# EasyEDA Pro project ProPrj_两相交错电源demo_2025-05-26.epro, schematic Schematic5
Board Name: 5143数控板; Create Date: 2025-05-10; Page Name: P1; Project Name: 两相交错电源demo; Schematic Name: Schematic5; Update Date: 2025-05-23; Company: 嘉立创EDA; Page Size: A4; Version: V1.0
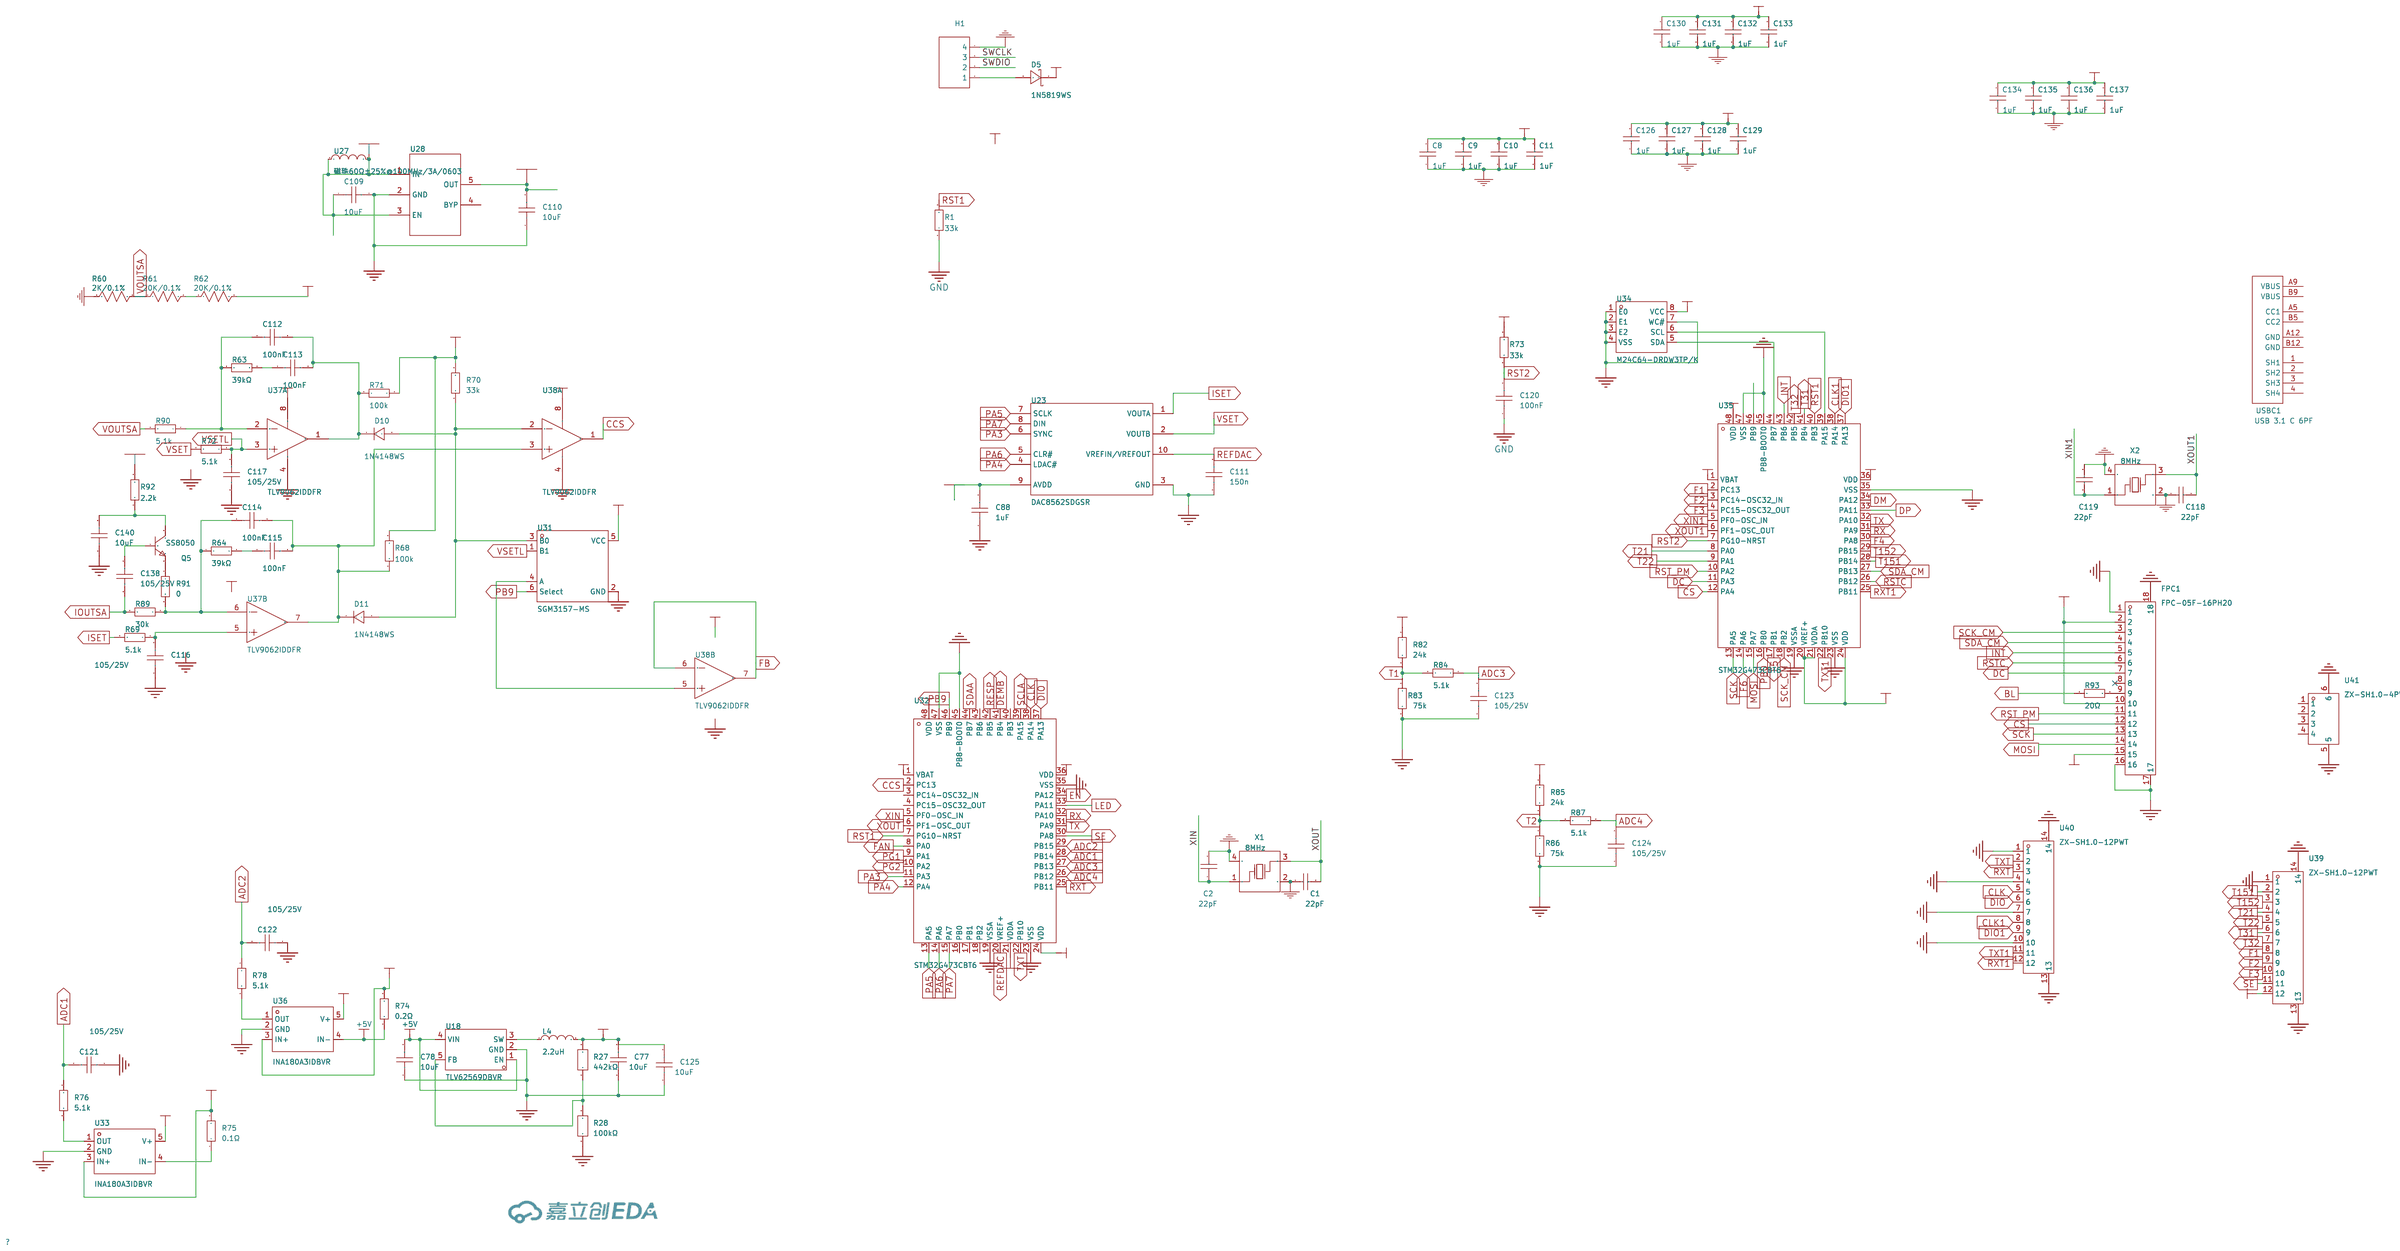
[diagram p5: schematic sheet]

## Parts
C1  22pF  [C0603]
C2  22pF  [C0603]
C8  1uF  [C0603]
C9  1uF  [C0603]
C10  1uF  [C0603]
C11  1uF  [C0603]
C77  10uF  [C0603]
C78  10uF  [C0603]
C88  1uF  [C0603]
C109  10uF  [C0603]
C110  10uF  [C0603]
C111  150n  [C0603]
C112  100nF  [C0603]
C113  100nF  [C0603]
C114  100nF  [C0603]
C115  100nF  [C0603]
C116  105/25V  [C0603]
C117  105/25V  [C0603]
C118  22pF  [C0603]
C119  22pF  [C0603]
C120  100nF  [C0603]
C121  105/25V  [C0603]
C122  105/25V  [C0603]
C123  105/25V  [C0603]
C124  105/25V  [C0603]
C125  10uF  [C0603]
C126  1uF  [C0603]
C127  1uF  [C0603]
C128  1uF  [C0603]
C129  1uF  [C0603]
C130  1uF  [C0603]
C131  1uF  [C0603]
C132  1uF  [C0603]
C133  1uF  [C0603]
C134  1uF  [C0603]
C135  1uF  [C0603]
C136  1uF  [C0603]
C137  1uF  [C0603]
C138  105/25V  [C0603]
C140  10uF  [C0603]
D5  1N5819WS  [SOD-323_L1.8-W1.3-LS2.5-RD]
D10  1N4148WS  [SOD-323_L1.8-W1.3-LS2.5-RD]
D11  1N4148WS  [SOD-323_L1.8-W1.3-LS2.5-RD]
FPC1  FPC-05F-16PH20  [FPC-SMD_16P-P0.50_FPC-05F-16PH20]
H1  Header-Male-2.54_1x4  [HDR-TH_4P-P2.54-V-M]
L4  2.2uH  [IND-SMD_L4.9-W4.4_MAPM0420F]
Q5  SS8050  [SOT-23-3_L2.9-W1.3-P1.90-LS2.4-BR]
R1  33k  [R0603]
R27  442kΩ  [R0603]
R28  100kΩ  [R0603]
R60  2K/0.1%  [R0603]
R61  20K/0.1%  [R0603]
R62  20K/0.1%  [R0603]
R63  39kΩ  [R0603]
R64  39kΩ  [R0603]
R68  100k  [R0603]
R69  5.1k  [R0603]
R70  33k  [R0603]
R71  100k  [R0603]
R72  5.1k  [R0603]
R73  33k  [R0603]
R74  0.2Ω  [R0603]
R75  0.1Ω  [R0603]
R76  5.1k  [R0603]
R78  5.1k  [R0603]
R82  24k  [R0603]
R83  75k  [R0603]
R84  5.1k  [R0603]
R85  24k  [R0603]
R86  75k  [R0603]
R87  5.1k  [R0603]
R89  30k  [R0603]
R90  5.1k  [R0603]
R91  0  [R0603]
R92  2.2k  [R0603]
R93  20Ω  [R0805]
U18  TLV62569DBVR  [SOT-23-5_L3.0-W1.7-P0.95-LS2.8-BR]
U23  DAC8562SDGSR  [VSSOP-10_L3.0-W3.0-P0.50-LS4.9-BL]
U27  磁珠60Ω±25%@100MHz/3A/0603  [L0603]
U28  -  [SOT-23-5_L3.0-W1.7-P0.95-LS2.8-TL]
U31  SGM3157-MS  [SC-70-6_L2.0-W1.3-P0.65-LS2.1-BL]
U32  STM32G473CBT6  [LQFP-48_L7.0-W7.0-P0.50-LS9.0-BL]
U33  INA180A3IDBVR  [SOT-23-5_L3.0-W1.7-P0.95-LS2.8-BR]
U34  M24C64-DRDW3TP/K  [TSSOP-8_L4.4-W3.0-P0.65-LS6.4-BL]
U35  STM32G473CBT6  [LQFP-48_L7.0-W7.0-P0.50-LS9.0-BL]
U36  INA180A3IDBVR  [SOT-23-5_L3.0-W1.7-P0.95-LS2.8-BR]
U37  TLV9062IDDFR  [TSOT-23-8_L2.9-W1.6-P0.65-LS2.8-BL]  (sections 1,2)
U38  TLV9062IDDFR  [TSOT-23-8_L2.9-W1.6-P0.65-LS2.8-BL]  (sections 1,2)
U39  ZX-SH1.0-12PWT  [CONN-SMD_ZX-SH1.0-12PWT]
U40  ZX-SH1.0-12PWT  [CONN-SMD_ZX-SH1.0-12PWT]
U41  ZX-SH1.0-4PWT  [CONN-SMD_4P-P1.00_MEGASTAR_ZX-SH1.0-4PWT]
USBC1  USB 3.1 C 6PF  [USB-C-SMD_TYPE-C-USB-13]
X1  8MHz  [OSC-SMD_4P-L3.2-W2.5-BL]
X2  8MHz  [OSC-SMD_4P-L3.2-W2.5-BL]

## Library data of the parts
C1 C2 C118 C119 = 22pF: Supplier: LCSC; Manufacturer: FH; Manufacturer Part: 0402CG150J500NT; Supplier Part: C1548; JLCPCB Part Class: Basic Part
C8-C11 C126-C137 = 100nF: Supplier: LCSC; Manufacturer: YAGEO; Manufacturer Part: CC0603KRX7R8BB334; Supplier Part: C107070; JLCPCB Part Class: Extended Part
C77 C78 C125 = CL10A475KO8NNNC: 容值:4.7uF;精度:±10%;额定电压:16V;材质(温度系数):X5R;; LCSC Part Name: 4.7uF ±10% 16V; Supplier Part: C19666; Manufacturer: SAMSUNG(三星); Supplier Footprint: 0603; JLCPCB Part Class: 基础库; Datasheet: https://atta.szlcsc.com/upload/public/pdf/source/20160218/1457707763339.pdf; Supplier: LCSC; Tolerance: ±10%; Voltage Rated: 16V; Temperature Coefficient: X5R
C88 C111 = CL10F105ZP8NNNC: 容值:1uF;精度:-20%~+80%;额定电压:10V;材质(温度系数):Y5V;; LCSC Part Name: 1uF -20%~+80% 10V; Supplier Part: C84710; Manufacturer: SAMSUNG(三星); Supplier Footprint: 0603; JLCPCB Part Class: 扩展库; Datasheet: https://atta.szlcsc.com/upload/public/pdf/source/20161228/1482890885897.pdf; Supplier: LCSC; Tolerance: -20%~+80%; Voltage Rated: 10V; Temperature Coefficient: Y5V
C109 C110 C140 = C0805S102K1RAC7800: 容值:1nF;精度:±10%;额定电压:100V;温度系数:X7R;; LCSC Part Name: 1nF ±10% 100V; Supplier Part: C141167; Manufacturer: KEMET(基美); Supplier Footprint: 0805; Datasheet: https://atta.szlcsc.com/upload/public/pdf/source/20171201/C141167_15121177000921156234.pdf; Supplier: LCSC; Tolerance: ±10%; Voltage Rated: 100V; Temperature Coefficient: X7R
C112-C115 C120 = CC0603KRX7R9BB104: 容值:100nF;精度:±10%;额定电压:50V;材质(温度系数):X7R;; LCSC Part Name: 100nF ±10% 50V; Supplier Part: C14663; Manufacturer: YAGEO(国巨); Supplier Footprint: 0603; JLCPCB Part Class: 基础库; Datasheet: https://atta.szlcsc.com/upload/public/pdf/source/20180910/C282072_33301C7F631E79921B82A8DAC6BCC5B3.pdf; Supplier: LCSC; Tolerance: ±10%; Voltage Rated: 50V; Temperature Coefficient: X7R
C116 C117 C121-C124 C138 = 105/25V: Supplier: LCSC
D5 = 1N5819WS_C191023: 正向压降(Vf):600mV@1A;直流反向耐压(Vr):40V;整流电流:1A;; LCSC Part Name: 电压:40V 电流:1A; Supplier Part: C191023; Manufacturer: Hottech(合科泰); Supplier Footprint: SOD-323; JLCPCB Part Class: 基础库; Datasheet: https://atta.szlcsc.com/upload/public/pdf/source/20220428/3CB86FD8D28D653594B4E35F9D5AEFD9.pdf; Supplier: LCSC; Forward Voltage (Vf@If): 600mV@1A; Reverse Voltage (Vr): 40V; Rectified Current: 1A
D10 D11 = 1N4148WS_C2128: 二极管配置:独立式;正向压降(Vf):1.25V@150mA;直流反向耐压(Vr):100V;整流电流:150mA;反向恢复时间(Trr):4ns;; LCSC Part Name: 丝印T4 1N4148WS; Supplier Part: C2128; Manufacturer: CJ(江苏长电/长晶); Supplier Footprint: SOD-323; JLCPCB Part Class: 基础库; Datasheet: https://atta.szlcsc.com/upload/public/pdf/source/20140809/1457707208178.pdf; Supplier: LCSC; Diode Configuration: 独立式; Voltage - Forward(Vf@If): 1.25V@150mA; Voltage - DC Reverse(Vr): 100V; Current - Rectified: 150mA; Reverse Leakage Current (Ir): 1uA@75V; Reverse Recovery Time (trr): 4ns
FPC1 = FPC-05F-16PH20: 锁定特性:翻盖式;触点类型:下接;触点数量:16P;间距:0.5mm;安装类型:卧贴;工作温度范围:-25℃~+85℃;; LCSC Part Name: 间距:0.5mm P数:16P 翻盖式 下接; Supplier Part: C2856801; Manufacturer: XUNPU(讯普); Supplier Footprint: SMD,P=0.5mm,卧贴; JLCPCB Part Class: 扩展库; Datasheet: https://atta.szlcsc.com/upload/public/pdf/source/20210922/C2856801_73A554E58C5577257FCEC843978D3BA6.pdf; Supplier: LCSC; Locking Feature: 翻盖式; Contact Type: 下接; Number of Contacts: 16P; Pitch: 0.5mm; Mounting Type: 卧贴; FFC, FCB Thickness: 0.3mm; Height Above Board: 2mm; Operating Temperature Range: -25℃~+85℃
H1 = Header-Male-2.54_1x4: Supplier: LCSC; Manufacturer: Ckmtw; Manufacturer Part: 210S-1*4P L=11.6MMGold-plated black; Supplier Part: C124378; JLCPCB Part Class: Extended Part
L4 = HA42-4R7MT: 电感值:4.7uH;精度:±20%;额定电流:2A;饱和电流(Isat):3A;; LCSC Part Name: 4.7uH ±20% 3A; Supplier Part: C2936653; Manufacturer: FH(风华); Supplier Footprint: 0420; JLCPCB Part Class: 扩展库; Datasheet: https://atta.szlcsc.com/upload/public/pdf/source/20211228/DF5AAD1C624D1DACD739A51BD94418BC.pdf; Supplier: LCSC; Tolerance: ±20%; Rated Current: 2A; Saturation Current (Isat): 3A; DC Resistance (DCR): 150mΩ
Q5 = SS8050_C2150: 晶体管类型:NPN;集电极电流(Ic):1.5A;集射极击穿电压(Vceo):25V;功率(Pd):300mW;直流电流增益(hFE@Ic,Vce):200@100mA,1V;; LCSC Part Name: SS8050(RANGE:200-350) hfe=200~350; Supplier Part: C2150; Manufacturer: CJ(江苏长电/长晶); Supplier Footprint: SOT-23; Datasheet: https://atta.szlcsc.com/upload/public/pdf/source/20230322/AEE86F4B043774EFF80CAEA14A37D9E9.pdf; Supplier: LCSC; Transistor Type: NPN; Collector Current (Ic): 1.5A; Collector-Emitter Breakdown Voltage (Vceo): 25V; Power Dissipation (Pd): 300mW; DC Current Gain (hFE@Ic,Vce): 200@100mA,1V; Transition Frequency (fT): 100MHz; Collector Cut-Off Current (Icbo): 100nA; Collector-Emitter Saturation Voltage (VCE(sat)@Ic,Ib): 500mV@800mA,80mA
R1 R68-R73 R76 R78 R82-R87 R89-R92 = 0603WAF1002T5E: LCSC Part Name: 10KΩ(1002) ±1% 编带; Supplier Part: C25804; Manufacturer: UNI-ROYAL(厚声); Supplier Footprint: 0603; JLCPCB Part Class: Basic Part; Datasheet: https://atta.szlcsc.com/upload/public/pdf/source/20170920/C25804_1505901551523983377.pdf; Supplier: LCSC
R27 = AR03BTCX2703: 电阻类型:薄膜电阻;阻值:270kΩ;精度:±0.1%;功率:100mW;最大工作电压:50V;温度系数:±25ppm/℃;; LCSC Part Name: 薄膜电阻 270kΩ ±0.1% 100mW; Supplier Part: C2828628; Manufacturer: Viking(光颉); Supplier Footprint: 0603; JLCPCB Part Class: 扩展库; Datasheet: https://atta.szlcsc.com/upload/public/pdf/source/20211009/C2828650_32843A9D611245FFE6ACF70CB68068A1.pdf; Supplier: LCSC; Type: 薄膜电阻; Tolerance: ±0.1%; Power(Watts): 100mW; Overload Voltage (Max): 50V; Temperature Coefficient: ±25ppm/℃; Operating Temperature Range: -55℃~+155℃
R28 = 0603WAF6002T5E: 电阻类型:厚膜电阻;阻值:60kΩ;精度:±1%;功率:100mW;最大工作电压:75V;温度系数:±100ppm/℃;; LCSC Part Name: 60kΩ ±1% 100mW 厚膜电阻; Supplier Part: C2767205; Manufacturer: UNI-ROYAL(厚声); Supplier Footprint: 0603; JLCPCB Part Class: 扩展库; Datasheet: https://atta.szlcsc.com/upload/public/pdf/source/20200306/C422600_1E6D84923E4A46A82E41ADD87F860B5C.pdf; Supplier: LCSC; Type: 厚膜电阻; Tolerance: ±1%; Power(Watts): 100mW; Overload Voltage (Max): 75V; Temperature Coefficient: ±100ppm/℃; Operating Temperature Range: -55℃~+155℃
R60 = 2K/0.1%: Supplier: LCSC
R61 R62 = 20K/0.1%: Supplier: LCSC
R63 R64 = 0603WAF3902T5E: 电阻类型:厚膜电阻;阻值:39kΩ;精度:±1%;功率:100mW;最大工作电压:75V;温度系数:±100ppm/℃;; LCSC Part Name: 39kΩ ±1% 100mW 厚膜电阻; Supplier Part: C23153; Manufacturer: UNI-ROYAL(厚声); Supplier Footprint: 0603; Datasheet: https://atta.szlcsc.com/upload/public/pdf/source/20200306/C422600_1E6D84923E4A46A82E41ADD87F860B5C.pdf; Supplier: LCSC; Type: 厚膜电阻; Tolerance: ±1%; Power(Watts): 100mW; Overload Voltage (Max): 75V; Temperature Coefficient: ±100ppm/℃; Operating Temperature Range: -55℃~+155℃
R74 R75 = 0603WAF100KT5E: 电阻类型:厚膜电阻;阻值:1Ω;精度:±1%;功率:100mW;最大工作电压:75V;温度系数:±400ppm/℃;; LCSC Part Name: 1Ω ±1% 100mW 厚膜电阻; Supplier Part: C22936; Manufacturer: UNI-ROYAL(厚声); Supplier Footprint: 0603; JLCPCB Part Class: 基础库; Datasheet: https://atta.szlcsc.com/upload/public/pdf/source/20200306/C422600_1E6D84923E4A46A82E41ADD87F860B5C.pdf; Supplier: LCSC; Type: 厚膜电阻; Tolerance: ±1%; Power(Watts): 100mW; Overload Voltage (Max): 75V; Temperature Coefficient: ±400ppm/℃; Operating Temperature Range: -55℃~+155℃
R93 = 0805W8F100KT5E: 电阻类型:厚膜电阻;阻值:1Ω;精度:±1%;功率:125mW;最大工作电压:150V;温度系数:±400ppm/℃;; LCSC Part Name: 1Ω ±1% 125mW 厚膜电阻; Supplier Part: C25271; Manufacturer: UNI-ROYAL(厚声); Supplier Footprint: 0805; JLCPCB Part Class: 基础库; Datasheet: https://atta.szlcsc.com/upload/public/pdf/source/20200306/C422600_1E6D84923E4A46A82E41ADD87F860B5C.pdf; Supplier: LCSC; Type: 厚膜电阻; Tolerance: ±1%; Power(Watts): 125mW; Overload Voltage (Max): 150V; Temperature Coefficient: ±400ppm/℃; Operating Temperature Range: -55℃~+155℃
U18 = TLV62569DBVR: 功能类型:降压型;输出类型:可调;工作电压:2.5V~5.5V;输出电压:600mV~5.5V;输出电流:2A;; LCSC Part Name: 高效率同步降压转换器; Supplier Part: C141836; Manufacturer: TI(德州仪器); Supplier Footprint: SOT-23-5; JLCPCB Part Class: 扩展库; Datasheet: https://www.ti.com/cn/lit/gpn/tlv62569; Supplier: LCSC; Function: 降压型; Output Type: 可调; Input Voltage: 2.5V~5.5V; Output Voltage: 600mV~5.5V; Output Current: 2A; Switching Frequency: 1.5MHz; Operating Temperature: -40℃~+125℃@(TJ); Synchronous Rectification: 是; Topology: 降压式; Switch tube (built-in/external): 内置
U23 = DAC8562SDGSR: DAC8562 具有 2.5V、4ppm/°C 基准的 16 位、双通道、低功耗、超低毛刺脉冲、电压输出 DAC; Supplier Part: C127965; Manufacturer: TI(德州仪器); Supplier Footprint: VSSOP-10-0.5mm; JLCPCB Part Class: 扩展库; Datasheet: https://www.ti.com/cn/lit/gpn/dac8562; Supplier: LCSC
U27 = 磁珠60Ω±25%@100MHz/3A/0603: Supplier Part: C9900021622; Supplier Footprint: 0603; JLCPCB Part Class: 扩展库; Supplier: LCSC
U28 = SPX3819M5-L-5-0/TR: 输出类型:固定;输出极性:正;输出通道数:1;最大输入电压:16V;输出电压:5V;压差:700mV@(500mA);输出电流:500mA;电源纹波抑制比(PRSS):-;; LCSC Part Name: Vin=16V Vout=5V 500mA; Supplier Part: C13417; Manufacturer: MaxLinear; Supplier Footprint: SOT-23-5; Datasheet: https://atta.szlcsc.com/upload/public/pdf/source/20150720/1457707331934.pdf; Supplier: LCSC; Output Type: 固定; Output Polarity: 正; Number of Outputs: 1; Maximum Input Voltage: 16V; Output Voltage: 5V; Dropout Voltage: 700mV@(500mA); Output Current: 500mA
U31 = SGM3157-MS: 此款高性能模拟开关，采用单刀双掷（SPDT）结构，单一通道设计精简高效。支持宽电压操作，确保广泛兼容性。让信号传输无缝对接，被广泛适用于音频切换、射频切换、数据采集系统、多路复用器、测试与测量设备等需要高性能模拟开关的应用场景。; Supplier Part: C30602480; Manufacturer: MSKSEMI(美森科); Supplier Footprint: SC-70-6; Datasheet: https://atta.szlcsc.com/upload/public/pdf/source/20240809/D2FA955BEE86AA69D9FAF919AB73E68A.pdf; Supplier: LCSC
U32 U35 = STM32G473CBT6: LCSC Part Name: 带DSP和FPU的170MHz主流ARM Cortex-M4 MCU，具有128 KB Flash存储器、数学加速器和高模拟电平集成; Supplier Part: C730111; Manufacturer: ST(意法半导体); Supplier Footprint: LQFP-48(7x7); JLCPCB Part Class: 扩展库; Datasheet: https://atta.szlcsc.com/upload/public/pdf/source/20200902/C730111_19331807E2800E1C1C13BFFAAC550E20.pdf; Supplier: LCSC
U33 U36 = INA180A3IDBVR: 放大器数:单路;共模电压:-200mV~26V;增益:100V/V;带宽:150kHz;; Supplier Part: C122882; Manufacturer: TI(德州仪器); Supplier Footprint: SOT-23-5; JLCPCB Part Class: 扩展库; Datasheet: https://www.ti.com/cn/lit/gpn/ina180; Supplier: LCSC; Number of Channels: 单路; Vcm - Common Mode Voltage: -200mV~26V; Gain: 100V/V; Bandwidth: 150kHz; Voltage - Supply: 2.7V~5.5V; Operating Temperature: -40℃~+125℃
U34 = M24C64-DRDW3TP/K: 接口类型:I2C;存储容量:64Kbit;; LCSC Part Name: M24C64 DRDW3TP/K; Supplier Part: C2061594; Manufacturer: ST(意法半导体); Supplier Footprint: TSSOP-8; JLCPCB Part Class: 扩展库; Datasheet: https://atta.szlcsc.com/upload/public/pdf/source/20190322/C377947_09771CCC4A523B6546D9A29FC4568048.pdf; Supplier: LCSC; Interface Type: I2C; Memory Size: 64Kbit; Supply Voltage: 1.8V~5.5V; Operating Temperature: -40℃~+125℃
U37 U38 = TLV9062IDDFR: 放大器数:双路;增益带宽积(GBP):10MHz;输入偏置电流(Ib):0.5pA;压摆率(SR):6.5V/us;带宽(-3db):-;轨到轨:-;; Supplier Part: C2867884; Manufacturer: TI(德州仪器); Supplier Footprint: TSOT-23-8; JLCPCB Part Class: Extended Part; Datasheet: https://www.ti.com/cn/lit/gpn/tlv9062; Supplier: LCSC; Number of Circuits: 双路; Gain Bandwidth Product(GBP): 10MHz; Current - Input Bias(Ib): 0.5pA; Slew Rate(SR): 6.5V/us; Output Current: 50mA; Operating Temperature: -40℃~+125℃
U39 U40 = ZX-SH1.0-12PWT: 插针结构:1x12P;间距:1mm;安装方式:卧贴;参考系列:SH;总PIN数:12P;排数:1;每排PIN数:12;行距:-;额定电流:-;触头材质:黄铜;触头镀层:锡;工作温度范围:-;; LCSC Part Name: 1x12P 间距:1mm 卧贴 系列:SH; Supplier Part: C22366249; Manufacturer: Megastar(兆星); Supplier Footprint: SMD,P=1mm,卧贴; JLCPCB Part Class: 扩展库; Datasheet: https://atta.szlcsc.com/upload/public/pdf/source/20240326/10FD453CFB7A9AFCA8B3607CE25151C0.pdf; Supplier: LCSC; Pins Structure: 1x12P; Pitch: 1mm; Mounting Style: 卧贴; Reference Series: SH; Number of Pins: 12P; Number of Rows: 1; Number of PINs Per Row: 12; Contact Material: 黄铜; Contact Plating: 锡; Supplementary Features: 辅助焊脚; Colour: 米色; Z-Height of the Board: 3.15mm; X-Length of Bottom Edge on Board (Spacing Line): 14.35mm; Y-Width of Bottom Edge on Board: 5.05mm
U41 = ZX-SH1.0-4PWT: 插针结构:1x4P;间距:1mm;安装方式:卧贴;参考系列:SH;总PIN数:4P;排数:1;每排PIN数:4;行距:-;额定电流:-;触头材质:黄铜;触头镀层:锡;工作温度范围:-;; LCSC Part Name: 1x4P 间距:1mm 卧贴 系列:SH; Supplier Part: C7430446; Manufacturer: Megastar(兆星); Supplier Footprint: SMD,P=1mm,卧贴; JLCPCB Part Class: 扩展库; Datasheet: https://atta.szlcsc.com/upload/public/pdf/source/20230619/390816C24B7A0EB1D042395C380CEA99.pdf; Supplier: LCSC; Pins Structure: 1x4P; Pitch: 1mm; Mounting Style: 卧贴; Reference Series: SH; Number of Pins: 4P; Number of Rows: 1; Number of PINs Per Row: 4; Contact Material: 黄铜; Contact Plating: 锡; Supplementary Features: 辅助焊脚; Colour: 米色; Z-Height of the Board: 3.15mm; X-Length of Bottom Edge on Board (Spacing Line): 6.35mm; Y-Width of Bottom Edge on Board: 5.05mm
USBC1 = USB 3.1 C 6PF: Supplier: LCSC; Supplier Part: C168701; Manufacturer: 精拓金; Manufacturer Part: 918-418K2023S40005; JLCPCB Part Class: Extended Part
X1 X2 = 8MHz: Supplier: LCSC; Manufacturer: YXC; Manufacturer Part: X322512MSB4SI; Supplier Part: C9002; JLCPCB Part Class: Basic Part

## Nets
3V3: C8.2 C9.2 C10.2 C11.2 C77.2 C125.2 C126.2 C127.2 C128.2 C129.2 C130.2 C131.2 C132.2 C133.2 FPC1.2 FPC1.10 FPC1.15 L4.2 R27.2 R73.2 U32.1(VBAT) U32.24(VDD) U32.36(VDD) U32.48(VDD) U34.8(VCC) U35.1(VBAT) U35.20(VREF+) U35.21(VDDA) U35.24(VDD) U35.36(VDD) U35.48(VDD) U39.12
5VIN: R74.2 U36.3(IN+)
12V: R75.2 U33.3(IN+)
+3.3VA: C88.2 C110.2 C134.2 C135.2 C136.2 C137.2 R68.2 R70.2 R71.1 R82.1 R85.1 U23.9(AVDD) U28.5(OUT) U31.5(VCC) U32.21(VDDA) U33.5(V+) U36.5(V+) U37.8(V+) U38.8(V+)
+5V: C78.2 C109.1 R74.1 R92.2 U18.1(EN) U18.4(VIN) U27.1 U27.2 U28.1(IN) U28.3(EN) U36.4(IN-)
GND: C1.1 C2.2 C8.1 C9.1 C10.1 C11.1 C77.1 C78.1 C88.1 C109.2 C110.1 C111.1 C116.1 C117.1 C118.1 C119.2 C120.1 C121.1 C122.1 C123.1 C124.1 C125.1 C126.1 C127.1 C128.1 C129.1 C130.1 C131.1 C132.1 C133.1 C134.1 C135.1 C136.1 C137.1 C140.1 FPC1.1 FPC1.16 FPC1.17 FPC1.18 H1.4 R1.1 R28.1 R60.1 R83.2 R86.2 U18.2(GND) U23.3(GND) U28.2(GND) U31.2(GND) U32.19(VSSA) U32.23(VSS) U32.35(VSS) U32.45(PB8-BOOT0) U32.47(VSS) U33.2(GND) U34.1(E0) U34.2(E1) U34.3(E2) U34.4(VSS) U34.7(WC#) U35.19(VSSA) U35.23(VSS) U35.35(VSS) U35.45(PB8-BOOT0) U35.47(VSS) U36.2(GND) U37.4(V-) U38.4(V-) U39.1 U39.13 U39.14 U40.1 U40.4 U40.7 U40.10 U40.13 U40.14 U41.5 U41.6 X1.2(GND) X1.4(GND) X2.2(GND) X2.4(GND)
ADC1: C121.2 R76.1 U32.28(PB14)
ADC2: C122.2 R78.1 U32.29(PB15)
ADC3: C123.2 R84.1 U32.27(PB13)
ADC4: C124.2 R87.1 U32.26(PB12)
BAT+: D5.1(K)
BL: R93.1
CCS: U32.2(PC13) U38.1(OUT1)
CLK: U32.38(PA14) U40.5
CLK1: U35.38(PA14) U40.8
CS: FPC1.12 U35.12(PA4)
DC: FPC1.7 U35.11(PA3)
DEMB: U32.41(PB4)
DIO: U32.37(PA13) U40.6
DIO1: U35.37(PA13) U40.9
DM: U35.34(PA12)
DP: U35.33(PA11)
EN: U32.34(PA12)
F1: U35.2(PC13) U39.8
F2: U35.3(PC14-OSC32_IN) U39.9
F3: U35.4(PC15-OSC32_OUT) U39.10
F4: U35.30(PA8)
F5: U35.17(PB1)
F6: U35.14(PA6)
FAN: U32.8(PA0)
FB: U38.6(IN2-) U38.7(OUT2)
INT: FPC1.5 U35.43(PB6)
IOUTSA: C138.2 R89.2
ISET: R69.2 U23.1(VOUTA)
LED: U32.33(PA11)
MOSI: FPC1.14 U35.15(PA7)
PA3: U23.6(SYNC) U32.11(PA3)
PA4: U23.4(LDAC#) U32.12(PA4)
PA5: U23.7(SCLK) U32.13(PA5)
PA6: U23.5(CLR#) U32.14(PA6)
PA7: U23.8(DIN) U32.15(PA7)
PB0: U35.16(PB0)
PB9: U31.6(Select) U32.46(PB9)
PG1: U32.9(PA1)
PG2: U32.10(PA2)
REFDAC: C111.2 U23.10(VREFIN/VREFOUT) U32.20(VREF+)
RESP: U32.42(PB5)
RST1: R1.2 U32.7(PG10-NRST) U35.40(PB3)
RST2: C120.2 R73.1 U35.7(PG10-NRST)
RST_PM: FPC1.11 U35.10(PA2)
RSTC: FPC1.6 U35.26(PB12)
RX: U32.32(PA10) U35.31(PA9)
RXT: U32.25(PB11) U40.3
RXT1: U35.25(PB11) U40.12
SCK: FPC1.13 U35.13(PA5)
SCK_CM: FPC1.3 U35.18(PB2)
SCLA: U32.39(PA15)
SDA_CM: FPC1.4 U35.27(PB13)
SDAA: U32.44(PB7)
SE: U32.30(PA8) U39.11
SWCLK: H1.3
SWDIO: H1.2
T1: R82.2 R83.1 R84.2
T2: R85.2 R86.1 R87.2
T21: U35.8(PA0) U39.4
T22: U35.9(PA1) U39.5
T31: U35.41(PB4) U39.6
T32: U35.42(PB5) U39.7
T151: U35.28(PB14) U39.2
T152: U35.29(PB15) U39.3
TX: U32.31(PA9) U35.32(PA10)
TXT: U32.22(PB10) U40.2
TXT1: U35.22(PB10) U40.11
VOUT: R62.2
VOUTSA: R60.2 R61.1 R90.2
VSET: R72.2 U23.2(VOUTB)
VSETL: C117.2 R72.1 U31.1(B1) U37.3(IN1+)
XIN: C2.1 U32.5(PF0-OSC_IN) X1.1(OSC1)
XIN1: C119.1 U35.5(PF0-OSC_IN) X2.1(OSC1)
XOUT: C1.2 U32.6(PF1-OSC_OUT) X1.3(OSC2)
XOUT1: C118.2 U35.6(PF1-OSC_OUT) X2.3(OSC2)
$1N1306: D5.2(A) H1.1
$1N4002: R61.2 R62.1
$1N4020: C112.1 R63.1 R90.1 U37.2(IN1-)
$1N4948: C112.2 C113.2 D10.1(K) R71.2 U37.1(OUT1)
$1N5813: C113.1 R63.2
$1N6197: C114.2 C115.2 D11.1(K) R68.1 U37.7(OUT2) U38.3(IN1+)
$1N6211: C115.1 R64.2
$1N6287: C116.2 R69.1 U37.5(IN2+)
$1N6366: D10.2(A) D11.2(A) R70.1 U31.3(B0) U38.2(IN1-)
$1N8417: U31.4(A) U38.5(IN2+)
$1N9327: L4.1 U18.3(SW)
$1N9331: R27.1 R28.2 U18.5(FB)
$1N16419: U34.5(SDA) U35.44(PB7)
$1N16424: U34.6(SCL) U35.39(PA15)
$1N19231: R75.1 U33.4(IN-)
$1N19339: R76.2 U33.1(OUT)
$1N19592: R78.2 U36.1(OUT)
$1N32083: Q5.2(E) R91.1
$1N32091: C114.1 R64.1 R89.1 R91.2 U37.6(IN2-)
$1N32107: C138.1 Q5.1(B)
$1N32121: C140.2 Q5.3(C) R92.1
$1N42578: FPC1.9 R93.2

Not connected (* = marked no-connect by the designer): FPC1 8*; U28 4(BYP); U32 3(PC14-OSC32_IN) 4(PC15-OSC32_OUT) 16(PB0) 17(PB1) 18(PB2) 40(PB3) 43(PB6); U35 46(PB9); U41 1 2 3 4; USBC1 1(SH1) 2(SH2) 3(SH3) 4(SH4) A5(CC1) A9(VBUS) A12(GND) B5(CC2) B9(VBUS) B12(GND)
